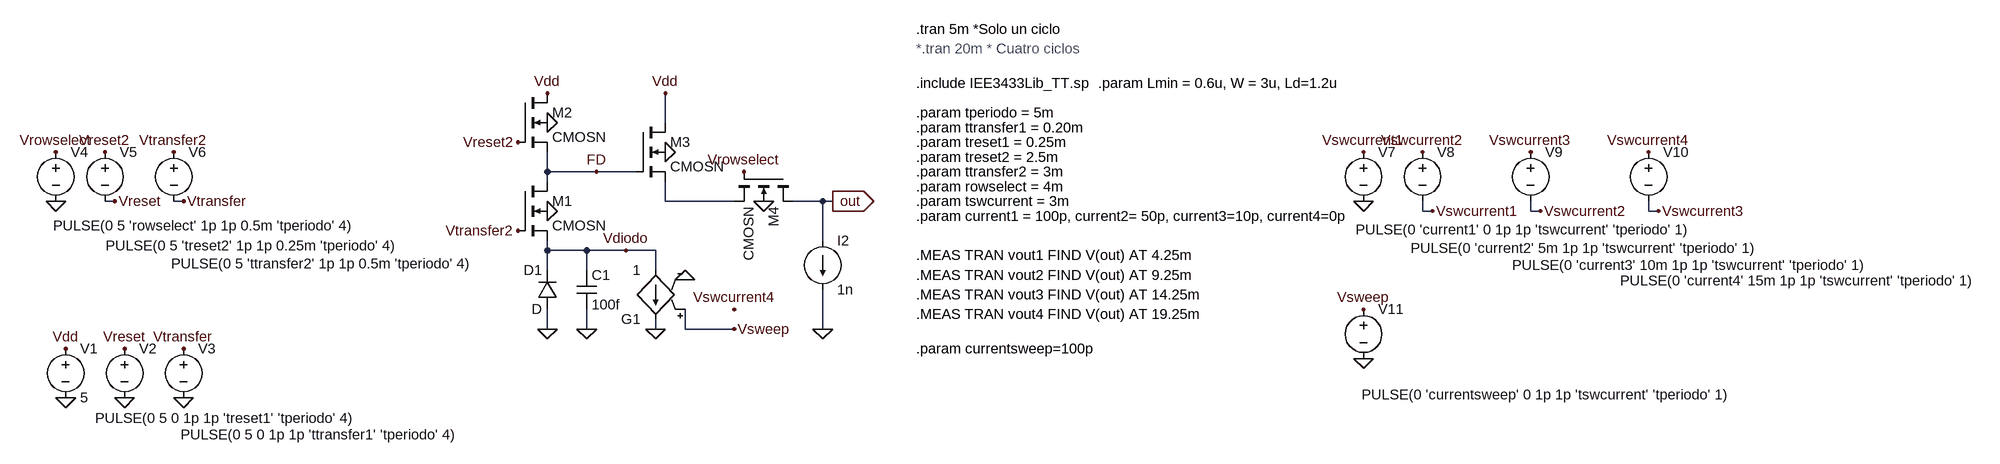
[diagram p0: schematic 4TAPS.asc]
4TAPS.asc, the LTspice schematic file:
Version 4
SHEET 1 2276 680
WIRE 80 -320 80 -368
WIRE -112 -240 -112 -272
WIRE -32 -240 -112 -240
WIRE 32 -240 -32 -240
WIRE -112 -224 -112 -240
WIRE -816 -192 -832 -192
WIRE -704 -192 -720 -192
WIRE 80 -192 80 -224
WIRE 192 -192 80 -192
WIRE 336 -192 288 -192
WIRE 352 -192 336 -192
WIRE 1312 -176 1312 -192
WIRE 1328 -176 1312 -176
WIRE 1488 -176 1488 -192
WIRE 1504 -176 1488 -176
WIRE 1680 -176 1680 -192
WIRE 1696 -176 1680 -176
WIRE 336 -128 336 -192
WIRE -112 -112 -112 -128
WIRE -48 -112 -112 -112
WIRE 16 -112 -48 -112
WIRE 64 -112 16 -112
WIRE -112 -80 -112 -112
WIRE -48 -80 -48 -112
WIRE 64 -80 64 -112
WIRE -112 16 -112 -16
WIRE -48 16 -48 -16
WIRE 64 16 64 0
WIRE 112 16 112 -16
WIRE 192 16 112 16
WIRE 336 16 336 -48
FLAG -896 128 0
FLAG -800 128 0
FLAG -704 128 0
FLAG -896 48 Vdd
FLAG -800 48 Vreset
FLAG -704 48 Vtransfer
FLAG -48 16 0
FLAG -112 16 0
FLAG 64 16 0
FLAG -112 -176 0
FLAG -160 -144 Vtransfer2
FLAG -912 -192 0
FLAG -912 -272 Vrowselect
FLAG -160 -288 Vreset2
FLAG -112 -368 Vdd
FLAG -112 -320 0
FLAG 80 -368 Vdd
FLAG 80 -272 0
FLAG 336 16 0
FLAG 240 -192 0
FLAG 208 -240 Vrowselect
FLAG -816 -192 Vreset
FLAG -832 -272 Vreset2
FLAG -704 -192 Vtransfer
FLAG -720 -272 Vtransfer2
FLAG 16 -112 Vdiodo
FLAG 112 -64 0
FLAG 1216 -192 0
FLAG 1216 -272 Vswcurrent1
FLAG 192 -16 Vswcurrent4
FLAG 1312 -272 Vswcurrent2
FLAG 1328 -176 Vswcurrent1
FLAG 1504 -176 Vswcurrent2
FLAG 1488 -272 Vswcurrent3
FLAG 1696 -176 Vswcurrent3
FLAG 1680 -272 Vswcurrent4
FLAG -32 -240 FD
FLAG 352 -192 out
IOPIN 352 -192 Out
FLAG 1216 64 0
FLAG 1216 -16 Vsweep
FLAG 192 16 Vsweep
SYMBOL voltage -896 32 R0
SYMATTR InstName V1
SYMATTR Value 5
SYMBOL voltage -800 32 R0
WINDOW 3 -48 129 Left 2
WINDOW 123 0 0 Left 2
WINDOW 39 0 0 Left 2
SYMATTR Value PULSE(0 5 0 1p 1p 'treset1' 'tperiodo' 4)
SYMATTR InstName V2
SYMBOL voltage -704 32 R0
WINDOW 123 0 0 Left 2
WINDOW 39 0 0 Left 2
WINDOW 3 -5 156 Left 2
SYMATTR Value PULSE(0 5 0 1p 1p 'ttransfer1' 'tperiodo' 4)
SYMATTR InstName V3
SYMBOL nmos4 -160 -224 R0
SYMATTR InstName M1
SYMATTR Value CMOSN
SYMATTR Value2 l='Lmin' w='W' ad='W*Ld' as='W*Ld' pd='2*W+2*Ld' ps='2*W+2*Ld' m=1
SYMBOL diode -96 -16 R180
WINDOW 0 24 64 Left 2
WINDOW 3 24 0 Left 2
SYMATTR InstName D1
SYMBOL cap -64 -80 R0
SYMATTR InstName C1
SYMATTR Value 100f
SYMBOL voltage -912 -288 R0
WINDOW 123 0 0 Left 2
WINDOW 39 0 0 Left 2
WINDOW 3 -4 136 Left 2
SYMATTR Value PULSE(0 5 'rowselect' 1p 1p 0.5m 'tperiodo' 4)
SYMATTR InstName V4
SYMBOL nmos4 -160 -368 R0
SYMATTR InstName M2
SYMATTR Value CMOSN
SYMATTR Value2 l='Lmin' w='W' ad='W*Ld' as='W*Ld' pd='2*W+2*Ld' ps='2*W+2*Ld' m=1
SYMBOL nmos4 32 -320 R0
SYMATTR InstName M3
SYMATTR Value CMOSN
SYMATTR Value2 l='Lmin' w='W' ad='W*Ld' as='W*Ld' pd='2*W+2*Ld' ps='2*W+2*Ld' m=1
SYMBOL nmos4 288 -240 R90
SYMATTR InstName M4
SYMATTR Value CMOSN
SYMATTR Value2 l='Lmin' w='W' ad='W*Ld' as='W*Ld' pd='2*W+2*Ld' ps='2*W+2*Ld' m=1
SYMBOL current 336 -128 R0
WINDOW 123 0 0 Left 2
WINDOW 39 0 0 Left 2
SYMATTR InstName I2
SYMATTR Value 1n
SYMBOL voltage -832 -288 R0
WINDOW 3 1 168 Left 2
WINDOW 123 0 0 Left 2
WINDOW 39 0 0 Left 2
SYMATTR Value PULSE(0 5 'treset2' 1p 1p 0.25m 'tperiodo' 4)
SYMATTR InstName V5
SYMBOL voltage -720 -288 R0
WINDOW 123 0 0 Left 2
WINDOW 39 0 0 Left 2
WINDOW 3 -4 198 Left 2
SYMATTR Value PULSE(0 5 'ttransfer2' 1p 1p 0.5m 'tperiodo' 4)
SYMATTR InstName V6
SYMBOL g 64 16 R180
SYMATTR InstName G1
SYMATTR Value 1
SYMBOL voltage 1216 -288 R0
WINDOW 123 0 0 Left 2
WINDOW 39 0 0 Left 2
WINDOW 3 -13 142 Left 2
SYMATTR Value PULSE(0 'current1' 0 1p 1p 'tswcurrent' 'tperiodo' 1)
SYMATTR InstName V7
SYMBOL voltage 1312 -288 R0
WINDOW 123 0 0 Left 2
WINDOW 39 0 0 Left 2
WINDOW 3 -19 172 Left 2
SYMATTR Value PULSE(0 'current2' 5m 1p 1p 'tswcurrent' 'tperiodo' 1)
SYMATTR InstName V8
SYMBOL voltage 1488 -288 R0
WINDOW 123 0 0 Left 2
WINDOW 39 0 0 Left 2
WINDOW 3 -30 200 Left 2
SYMATTR Value PULSE(0 'current3' 10m 1p 1p 'tswcurrent' 'tperiodo' 1)
SYMATTR InstName V9
SYMBOL voltage 1680 -288 R0
WINDOW 123 0 0 Left 2
WINDOW 39 0 0 Left 2
WINDOW 3 -46 225 Left 2
SYMATTR Value PULSE(0 'current4' 15m 1p 1p 'tswcurrent' 'tperiodo' 1)
SYMATTR InstName V10
SYMBOL voltage 1216 -32 R0
WINDOW 123 0 0 Left 2
WINDOW 39 0 0 Left 2
WINDOW 3 -3 155 Left 2
SYMATTR Value PULSE(0 'currentsweep' 0 1p 1p 'tswcurrent' 'tperiodo' 1)
SYMATTR InstName V11
TEXT 488 -472 Left 2 !.tran 5m *Solo un ciclo
TEXT 488 -336 Left 2 !.param tperiodo = 5m
TEXT 488 -288 Left 2 !.param treset1 = 0.25m
TEXT 488 -312 Left 2 !.param ttransfer1 = 0.20m
TEXT 488 -384 Left 2 !.include IEE3433Lib_TT.sp
TEXT 488 -216 Left 2 !.param rowselect = 4m
TEXT 784 -384 Left 2 !.param Lmin = 0.6u, W = 3u, Ld=1.2u
TEXT 488 -264 Left 2 !.param treset2 = 2.5m
TEXT 488 -240 Left 2 !.param ttransfer2 = 3m
TEXT 488 -192 Left 2 !.param tswcurrent = 3m
TEXT 488 -168 Left 2 !.param current1 = 100p, current2= 50p, current3=10p, current4=0p
TEXT 488 -104 Left 2 !.MEAS TRAN vout1 FIND V(out) AT 4.25m
TEXT 488 -72 Left 2 !.MEAS TRAN vout2 FIND V(out) AT 9.25m
TEXT 488 -40 Left 2 !.MEAS TRAN vout3 FIND V(out) AT 14.25m
TEXT 488 -8 Left 2 !.MEAS TRAN vout4 FIND V(out) AT 19.25m
TEXT 488 48 Left 2 !.param currentsweep=100p
TEXT 488 -440 Left 2 ;*.tran 20m * Cuatro ciclos

The netlist it stands for:
* 4TAPS.asc
V1 Vdd 0 5
V2 Vreset 0 PULSE(0 5 0 1p 1p 'treset1' 'tperiodo' 4)
V3 Vtransfer 0 PULSE(0 5 0 1p 1p 'ttransfer1' 'tperiodo' 4)
M1 FD Vtransfer2 Vdiodo 0 CMOSN l='Lmin' w='W' ad='W*Ld' as='W*Ld' pd='2*W+2*Ld' ps='2*W+2*Ld' m=1
D1 0 Vdiodo D
C1 Vdiodo 0 100f
V4 Vrowselect 0 PULSE(0 5 'rowselect' 1p 1p 0.5m 'tperiodo' 4)
M2 Vdd Vreset2 FD 0 CMOSN l='Lmin' w='W' ad='W*Ld' as='W*Ld' pd='2*W+2*Ld' ps='2*W+2*Ld' m=1
M3 Vdd FD N001 0 CMOSN l='Lmin' w='W' ad='W*Ld' as='W*Ld' pd='2*W+2*Ld' ps='2*W+2*Ld' m=1
M4 out Vrowselect N001 0 CMOSN l='Lmin' w='W' ad='W*Ld' as='W*Ld' pd='2*W+2*Ld' ps='2*W+2*Ld' m=1
I2 out 0 1n
V5 Vreset2 Vreset PULSE(0 5 'treset2' 1p 1p 0.25m 'tperiodo' 4)
V6 Vtransfer2 Vtransfer PULSE(0 5 'ttransfer2' 1p 1p 0.5m 'tperiodo' 4)
G1 Vdiodo 0 Vsweep 0 1
V7 Vswcurrent1 0 PULSE(0 'current1' 0 1p 1p 'tswcurrent' 'tperiodo' 1)
V8 Vswcurrent2 Vswcurrent1 PULSE(0 'current2' 5m 1p 1p 'tswcurrent' 'tperiodo' 1)
V9 Vswcurrent3 Vswcurrent2 PULSE(0 'current3' 10m 1p 1p 'tswcurrent' 'tperiodo' 1)
V10 Vswcurrent4 Vswcurrent3 PULSE(0 'current4' 15m 1p 1p 'tswcurrent' 'tperiodo' 1)
V11 Vsweep 0 PULSE(0 'currentsweep' 0 1p 1p 'tswcurrent' 'tperiodo' 1)
.model D D
.lib standard.dio
.model NMOS NMOS
.model PMOS PMOS
.lib standard.mos
.tran 5m *Solo un ciclo
.param tperiodo = 5m
.param treset1 = 0.25m
.param ttransfer1 = 0.20m
.include IEE3433Lib_TT.sp
.param rowselect = 4m
.param Lmin = 0.6u, W = 3u, Ld=1.2u
.param treset2 = 2.5m
.param ttransfer2 = 3m
.param tswcurrent = 3m
.param current1 = 100p, current2= 50p, current3=10p, current4=0p
.MEAS TRAN vout1 FIND V(out) AT 4.25m
.MEAS TRAN vout2 FIND V(out) AT 9.25m
.MEAS TRAN vout3 FIND V(out) AT 14.25m
.MEAS TRAN vout4 FIND V(out) AT 19.25m
.param currentsweep=100p
* *.tran 20m * Cuatro ciclos
.backanno
.end